# Altium schematic sheet V1.1.SchDoc
size 254 x 165 mm; PageSetup: Record=PageOptions|CenterHorizontal=True|CenterVertical=True|PrintScale=0.85|XCorrection=1.00|YCorrection=1.00|PrintKind=0|BorderSize=5000000|LeftOffset=0|BottomOffset=0|Orientation=2|PaperLength=1000|PaperWidth=1000|Scale=100|PaperSource=15|PrintQuality=-3|MediaType=1|DitherType=10|PrintScaleMode=1|PaperKind=A4|PaperIndex=9
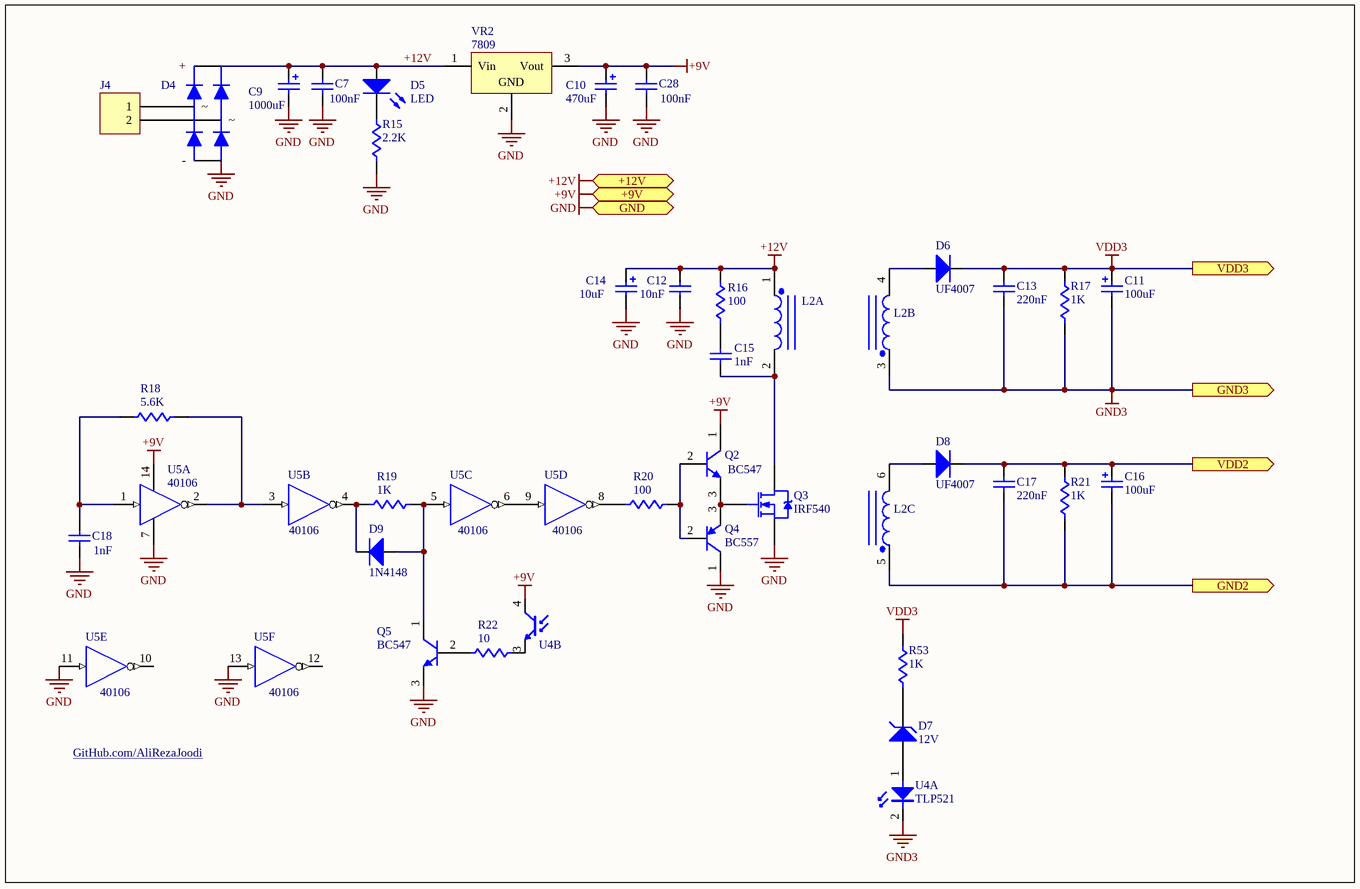
[diagram p0: V1.1.SchDoc]

## Parts
C7  value 100nF  [CAPNTO2.54-3.05x1.78A]  (hidden comment: Cap)
C9  value 1000uF  [CAPPR5-10x12.5]  (hidden comment: Cap Pol1)
C10  value 470uF  [CAPPR5-10x12.5]  (hidden comment: Cap Pol1)
C11  value 100uF  [CAPPR2.5-6.3x5]  (hidden comment: Cap Pol1)
C12  value 10nF  [CAPNTO2.54-3.05x1.78A]  (hidden comment: Cap)
C13  value 220nF  [CAPNTO5.08-7.37x3.94]  (hidden comment: Cap)
C14  value 10uF  [CAPPR2.5-6.3x5]  (hidden comment: Cap Pol1)
C15  value 1nF  [CAPNTO2.54-3.56x2.03]  (hidden comment: Cap)
C16  value 100uF  [CAPPR2.5-6.3x5]  (hidden comment: Cap Pol1)
C17  value 220nF  [CAPNTO5.08-7.37x3.94]  (hidden comment: Cap)
C18  value 1nF  [CAPNTO2.54-3.05x1.78A]  (hidden comment: Cap)
C28  value 100nF  [CAPNTO2.54-3.05x1.78A]  (hidden comment: Cap)
D4  Bridge_1  [KBP]  (value not drawn)
D5  LED  [LED-5mm_Red]
D6  UF4007  [DIODE-0.4]
D7  value 12V  [DIODE0.4_Glass]  (hidden comment: D Zener)
D8  UF4007  [DIODE-0.4]
D9  1N4148  [DIODE0.4_Glass]
J4  Header 2  [Fonics_2PIN_1]  (value not drawn)
L2  Inductor 3  [INDUCTOR3]  (value not drawn)  (parts A,B,C of 3)
Q2  Device: BC547  [TO92C]  (hidden comment: NPN)
Q3  IRF540  [TO220V]
Q4  BC557  [TO92C]
Q5  value BC547  [TO92C]  (hidden comment: NPN)
R15  value 2.2K  [AXIAL-0.4]  (hidden comment: Res1)
R16  value 100  [AXIAL-0.4]  (hidden comment: Res1)
R17  value 1K  [AXIAL-0.4]  (hidden comment: Res1)
R18  value 5.6K  [AXIAL-0.4]  (hidden comment: Res1)
R19  value 1K  [AXIAL-0.4]  (hidden comment: Res1)
R20  value 100  [AXIAL-0.4]  (hidden comment: Res1)
R21  value 1K  [AXIAL-0.4]  (hidden comment: Res1)
R22  value 10  [AXIAL-0.4]  (hidden comment: Res1)
R53  value 1K  [AXIAL-0.4]  (hidden comment: Res1)
U4  value TLP521  [DIP-4]  (hidden comment: Optoisolator)  (parts A,B of 2)
U5  value 40106  [DIP14]  (hidden comment: U?)  (parts A,B,C,D,E,F of 6)
VR2  value 7809  [TO220V]  (hidden comment: Volt Reg)

## Ports
+9V (out), +12V (out), GND2 (out), GND3 (out), GND (out), VDD2 (out), VDD3 (out)

## Nets
+9V: C10.1 C28.2 Q2.1(C) U4.4(C) U5.14(VDD) VR2.3(Vout) ; port +9V
+12V: C7.2 C9.1 C12.2 C14.1 D4.3(+) D5.1(A) L2.1 R16.1 VR2.1(Vin) ; port +12V
GND: C7.1 C9.2 C10.2 C12.1 C14.2 C18.1 C28.1 D4.1(-) Q3.3(S) Q4.1(C) Q5.3(E) R15.2 U5.7(VSS) U5.11(I) U5.13(I) VR2.2(GND) ; port GND
GND3: C11.2 C13.1 L2.3 R17.2 U4.2(K) ; port GND3
VDD3: C11.1 C13.2 D6.2(K) R17.1 R53.1 ; port VDD3
GND2: C16.2 C17.1 L2.5 R21.2 ; port GND2
VDD2: C16.1 C17.2 D8.2(K) R21.1 ; port VDD2
NetC15_1: C15.1 L2.2 Q3.2(D)
NetC15_2: C15.2 R16.2
NetC18_2: C18.2 R18.2 U5.1(I)
NetD4_2: D4.2 J4.2
NetD4_4: D4.4 J4.1
NetD5_2: D5.2(K) R15.1
NetD6_1: D6.1(A) L2.4
NetD7_1: D7.1(A) U4.1(A)
NetD7_2: D7.2(K) R53.2
NetD8_1: D8.1(A) L2.6
NetD9_1: D9.1(A) Q5.1(C) R19.1 U5.5(I)
NetD9_2: D9.2(K) R19.2 U5.4(~{O})
NetQ2_2: Q2.2(B) Q4.2(B) R20.2
NetQ2_3: Q2.3(E) Q3.1(G) Q4.3(E)
NetQ5_2: Q5.2(B) R22.1
NetR18_1: R18.1 U5.2(~{O}) U5.3(I)
NetR20_1: R20.1 U5.8(~{O})
NetR22_2: R22.2 U4.3(E)
NetU5_6: U5.6(~{O}) U5.9(I)

Not connected (* = marked no-connect by the designer): U5 10(~{O}) 12(~{O})

## Notes on the sheet
- GitHub.com/AliRezaJoodi

## Library data of the parts
C7 C12 C13 C15 C17 C18 C28 = Cap: Capacitor; Manufacturer: Generic Components; Class I: Passive; Published: 8-Jun-2000; Revision: July-2002: Re-released for DXP Platform.; Publisher: Altium Limited; Class II: Capacitor
C9-C11 C14 C16 = Cap Pol1: Polarized Capacitor (Radial); Manufacturer: Generic Components; Class I: Passive; Published: 8-Jun-2000; Revision: July-2002: Re-released for DXP Platform.; Publisher: Altium Limited; Class II: Capacitor
D4 = Bridge_1: Full Wave Diode Bridge; Manufacturer: Generic Components; Class I: Discrete; Class II: Rectifier - Bridge; Published: 8-Jun-2000; Revision: July-2002: Re-released for DXP Platform.; Publisher: Altium Limited
D5 = LED: Typical INFRARED GaAs LED; Manufacturer: Generic Components; Class I: Optoelectronic; Published: 8-Jun-2000; Revision: July-2002: Re-released for DXP Platform.; Publisher: Altium Limited; Class II: LED
D6 D8 D9 = Diode: Default Diode; Manufacturer: Generic Components; Class I: Discrete; Class II: Diode - Switching; Published: 8-Jun-2000; Revision: July-2002: Re-released for DXP Platform.; Publisher: Altium Limited
D7 = D Zener: Zener Diode; Manufacturer: Generic Components; Class I: Discrete; Class II: Diode - Zener; Published: 8-Jun-2000; Revision: July-2002: Re-released for DXP Platform.; Publisher: Altium Limited
J4 = Header 2: Header, 2-Pin; LatestRevisionDate: 17-Jul-2002; LatestRevisionNote: Re-released for DXP Platform.; Publisher: Altium Limited
Q2 = NPN: Silicon Bipolar Transistor; Package Reference: TO-92A
Q3 = IRFP141: 31A, 80V, 0.077 Ohm, N-Channel Power MOSFET; Note: Pin 2 (drain) is electrically connected to the case metal; Published: 8-Jun-2000; LatestRevisionDate: 17-Jul-2002; LatestRevisionNote: Re-released for DXP Platform.; DatasheetVersion: Jan-1998; PackageVersion: 1994; PackageReference: TO-247; Publisher: Altium Limited; PackageDescription: SIP with Mounting Hole; 3 Leads; Body 20.6 x 15.6 x 4.7 mm (typ); Pitch 5.56 mm; ComponentLink1Description: Manufacturer Link; ComponentLink1URL: http://www.intersil.com/cda/home/
Q4 = PNP: PNP Bipolar Transistor; Manufacturer: Generic Components; Class I: Discrete; Class II: BJT - Low Power; Published: 8-Jun-2000; Revision: July-2002: Re-released for DXP Platform.; Publisher: Altium Limited
Q5 = NPN: NPN Bipolar Transistor; Manufacturer: Generic Components; Class I: Discrete; Class II: BJT - Low Power; Published: 8-Jun-2000; Revision: July-2002: Re-released for DXP Platform.; Publisher: Altium Limited
R15-R22 R53 = Res1: Resistor; Manufacturer: Generic Components; Class I: Passive; Published: 8-Jun-2000; Revision: July-2002: Re-released for DXP Platform.; Publisher: Altium Limited; Class II: Resistor
U5 = 40106: Hex inverting Schmitt trigger, 14-Pin; Publisher: Altium Limited; ComponentLink1URL: http://www.nxp.com
VR2 = Volt Reg: Voltage Regulator; Manufacturer: Generic Components; Class I: Power Management; Published: 24-Mar-1999; Revision: July-2002: Re-released for DXP Platform.; Publisher: Altium Limited; Class II: Voltage Regulator
L2 = Inductor 3: Publisher: Altium Limited
U4 = Optoisolator: Publisher: Altium Limited